# EAGLE design ledcontrol (EAGLE 7.2.0)
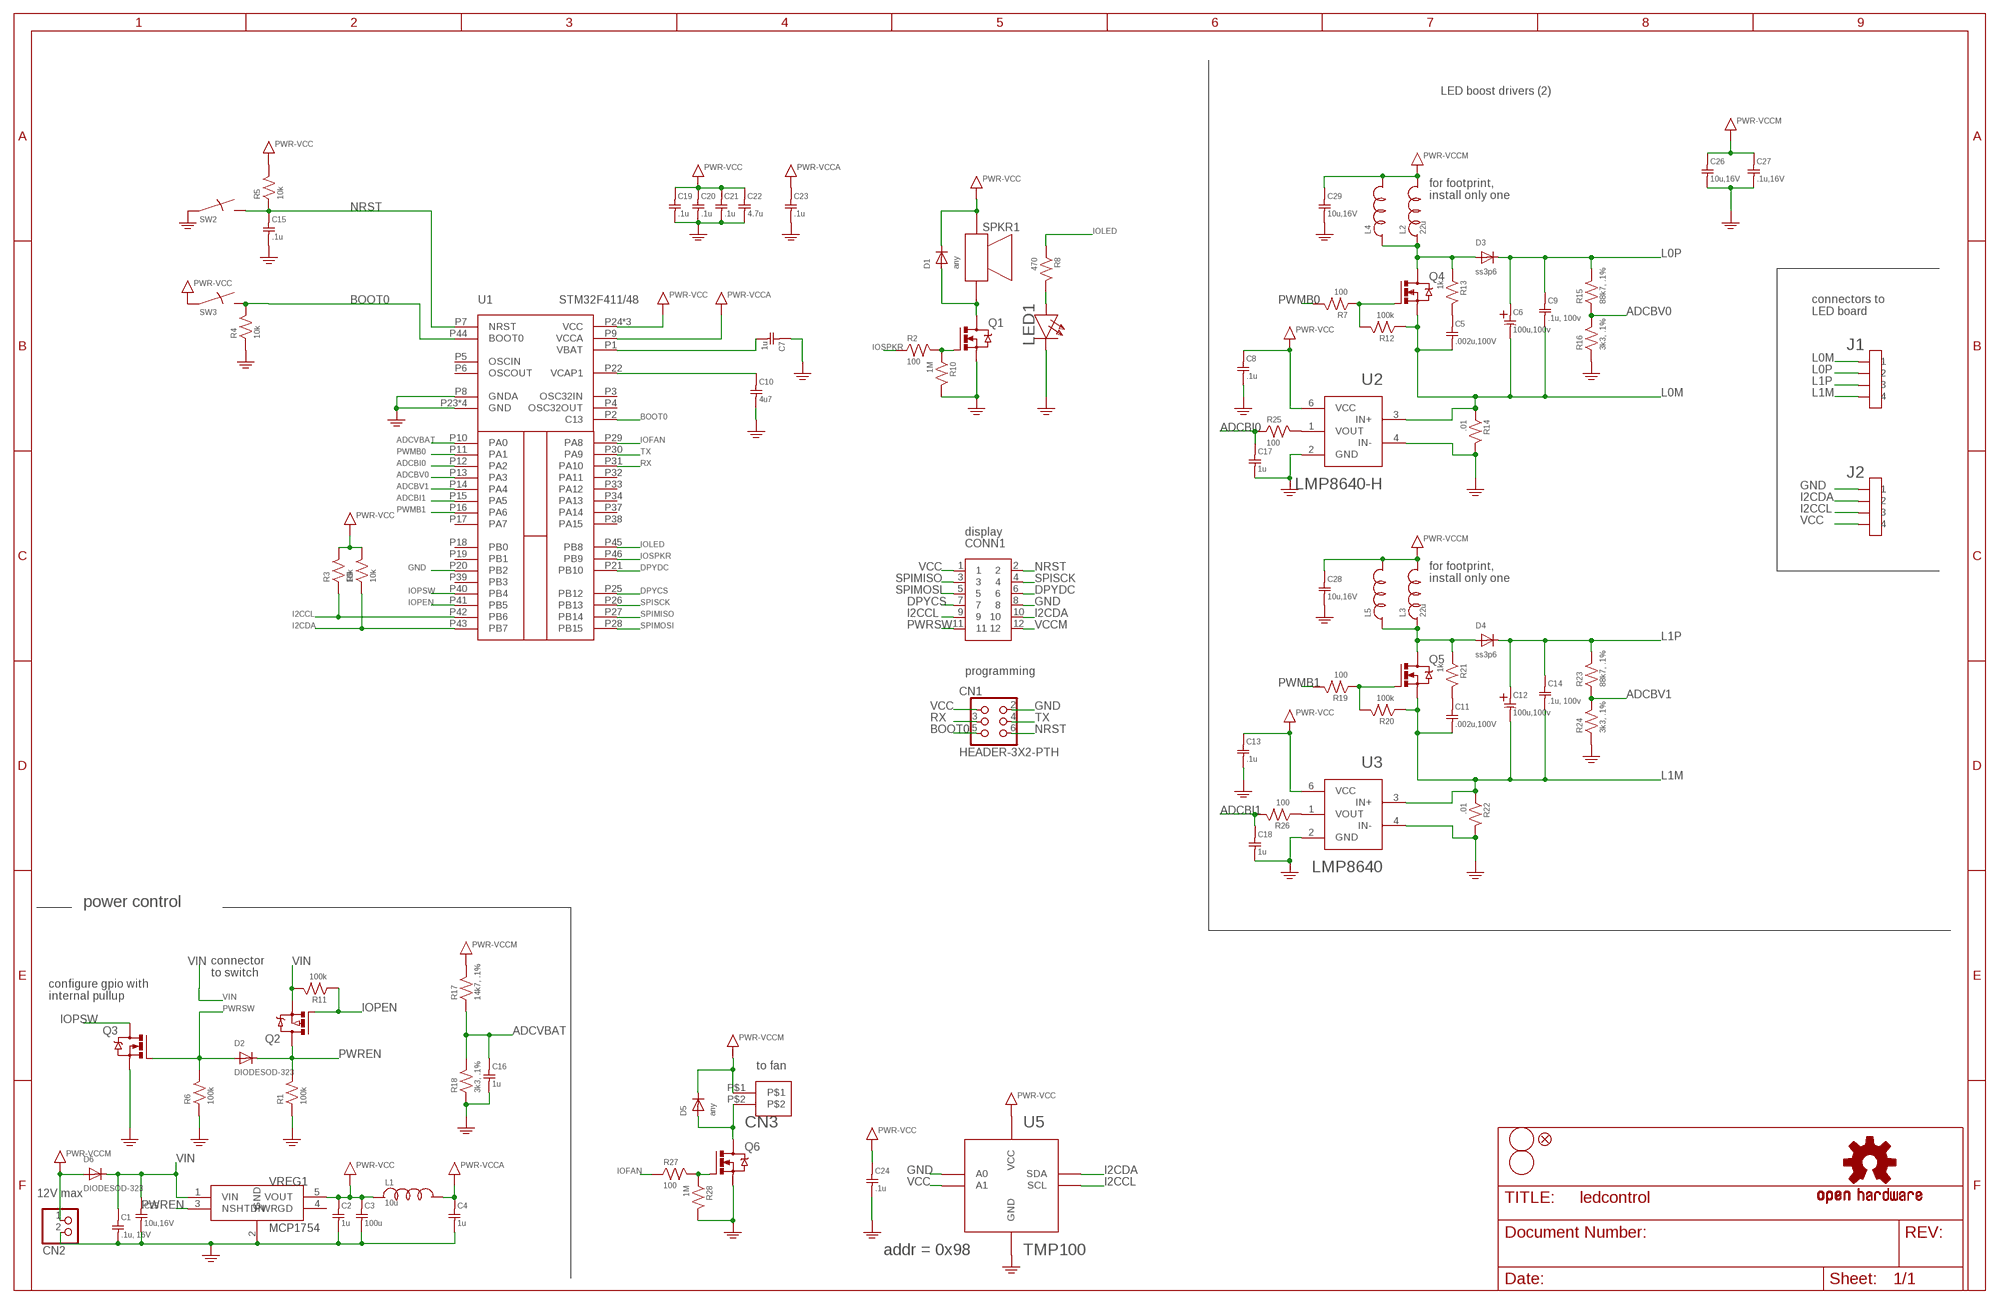
[diagram p0: schematic, sheet 1]

## Parts
C1  .1u, 16V  C0603  [SMD0603]
C2  1u  C0603  [SMD0603]
C3  100u  C1210  [SMD1210]
C4  1u  C0603  [SMD0603]
C5  .002u,100V  C0603  [SMD0603]
C6  100u,100v  C-POL-KE0  [CAPKE0]
C7  1u  C0603  [SMD0603]
C8  .1u  C0603  [SMD0603]
C9  .1u, 100v  C0805  [SMD0805]
C10  4u7  C0603  [SMD0603]
C11  .002u,100V  C0603  [SMD0603]
C12  100u,100v  C-POL-KE0  [CAPKE0]
C13  .1u  C0603  [SMD0603]
C14  .1u, 100v  C0805  [SMD0805]
C15  .1u  C0603  [SMD0603]
C16  1u  C0603  [SMD0603]
C17  1u  C0603  [SMD0603]
C18  1u  C0603  [SMD0603]
C19  .1u  C0603  [SMD0603]
C20  .1u  C0603  [SMD0603]
C21  .1u  C0603  [SMD0603]
C22  4.7u  C0603  [SMD0603]
C23  .1u  C0603  [SMD0603]
C24  .1u  C0603  [SMD0603]
C25  10u,16V  C0603  [SMD0603]
C26  10u,16V  C0603  [SMD0603]
C27  .1u,16V  C0603  [SMD0603]
C28  10u,16V  C0603  [SMD0603]
C29  10u,16V  C0603  [SMD0603]
CN1  HEADER-3X2-PTH  [HEADER-3X2-PTH]
CN2  JST_2PIN-THM-RA  [JST-PH-2-THM-RA]
CN3  HEADER-1X2-THM  [HEADER-1X2-THM]
CONN1  HEADER-6X2-PTH  [HEADER-6X2-PTH]
D1  any  DIODESOD-323  [SOD-323]
D2  DIODESOD-323  [SOD-323]
D3  ss3p6  DIODEDO-214AC  [DO-214AC]
D4  ss3p6  DIODEDO-214AC  [DO-214AC]
D5  any  DIODESOD-323  [SOD-323]
D6  DIODESOD-323  [SOD-323]
FID1  FIDUCIALUFIDUCIAL  [MICRO-FIDUCIAL]
J1  HEADER-4X1-PTH  [HEADER-4X1-PTH]
J2  HEADER-4X1-PTH  [HEADER-4X1-PTH]
L1  10u  LSMD0603  [SMD0603]
L2  22u  L2303  [BOURNS2303]
L3  22u  L2303  [BOURNS2303]
L4  L-SRR1260  [SRR1260]
L5  L-SRR1260  [SRR1260]
LED1  white  LED  [SMD0603D]
LOGO1  OSHW-LOGOS  [OSHW-LOGO-S]
Q1  IRLML6344TRPBF  MOSFETSOT-23  [SOT-23-3]
Q2  MOSFET-P  [SOT-23-3@1]
Q3  MOSFETSOT-23  [SOT-23-3]
Q4  AON6246  MOSFET-DFN5X6  [DFN5X6-8LEP1]
Q5  AON6246  MOSFET-DFN5X6  [DFN5X6-8LEP1]
Q6  IRLML6344TRPBF  MOSFETSOT-23  [SOT-23-3]
R1  100k  R0603  [SMD0603]
R2  100  R0603  [SMD0603]
R3  10k  R0603  [SMD0603]
R4  10k  R0603  [SMD0603]
R5  10k  R0603  [SMD0603]
R6  100k  R0603  [SMD0603]
R7  100  R0603  [SMD0603]
R8  470  R0603  [SMD0603]
R9  10k  R0603  [SMD0603]
R10  1M  R0603  [SMD0603]
R11  100k  R0603  [SMD0603]
R12  100k  R0603  [SMD0603]
R13  1k  R0603  [SMD0603]
R14  .01  R1206  [SMD1206]
R15  88k7, .1%  R0603  [SMD0603]
R16  3k3, .1%  R0603  [SMD0603]
R17  14k7, .1%  R0603  [SMD0603]
R18  3k3, .1%  R0603  [SMD0603]
R19  100  R0603  [SMD0603]
R20  100k  R0603  [SMD0603]
R21  1k  R0603  [SMD0603]
R22  .01  R1206  [SMD1206]
R23  88k7, .1%  R0603  [SMD0603]
R24  3k3, .1%  R0603  [SMD0603]
R25  100  R0603  [SMD0603]
R26  100  R0603  [SMD0603]
R27  100  R0603  [SMD0603]
R28  1M  R0603  [SMD0603]
SPKR1  PUI-5040  [PUI-0540]
SW2  SWITCHKMR211  [KMR211]
SW3  SWITCHKMR211  [KMR211]
U1  STM32F411/48  [UQPFN48]
U2  LMP8640-H  LMP8640  [SOT-23-6]
U3  LMP8640  [SOT-23-6]
U5  TMP100  [SOT-23-6]
U$1  FIDUCIAL  [FIDUCIAL_1MM]
U$2  FIDUCIAL  [FIDUCIAL_1MM]
VREG1  MCP1754  MCP1824  [SOT-23-5]

## Nets
ADCBI0: C17.1 R25.1 U1.P12(PA2)
ADCBI1: C18.1 R26.2 U1.P15(PA5)
ADCBV0: R15.1 R16.2 U1.P13(PA3)
ADCBV1: R23.1 R24.2 U1.P14(PA4)
ADCVBAT: C16.1 R17.1 R18.2 U1.P10(PA0)
BOOT0: CN1.5 R4.2 SW3.2 SW3.4 U1.P2(C13) U1.P44(BOOT0)
DPYCS: CONN1.7 U1.P25(PB12)
DPYDC: CONN1.6 U1.P21(PB10)
GND: C1.2 C2.2 C3.2 C4.2 C7.1 C8.2 C10.2 C13.2 C15.2 C16.2 C17.2 C18.2 C19.2 C20.2 C21.2 C22.2 C23.2 C24.2 C25.2 C26.2 C27.2 C28.2 C29.2 CN1.2 CN2.2 CONN1.8 J2.P$1 LED1.C Q1.2(S) Q3.2(S) Q6.2(S) R1.1 R4.1 R6.1 R10.2 R14.2 R16.1 R18.1 R22.2 R24.1 R28.2 SW2.1 SW2.3 U1.P8(GNDA) U1.P20(PB2) U1.P23(GND) U1.P35(GND) U1.P47(GND) U1.PAD(GND) U2.2(GND) U2.4(IN-) U3.2(GND) U3.4(IN-) U5.2(GND) U5.5(A0) VREG1.2(GND) ; supply symbol labelled PWR-GND
I2CCL: CONN1.9 J2.P$3 R3.1 U1.P42(PB6) U5.1(SCL)
I2CDA: CONN1.10 J2.P$2 R9.1 U1.P43(PB7) U5.6(SDA)
IOFAN: R27.1 U1.P29(PA8)
IOLED: R8.1 U1.P45(PB8)
IOPEN: Q2.1(G) R11.1 U1.P41(PB5)
IOPSW: Q3.3(D) U1.P40(PB4)
IOSPKR: R2.1 U1.P46(PB9)
L0M: C5.2 C6.N C9.2 J1.P$1 Q4.P$1(S) Q4.P$2(S) Q4.P$3(S) R12.1 R14.1 U2.3(IN+)
L0P: C6.P C9.1 D3.C J1.P$2 R15.2
L1M: C11.2 C12.N C14.2 J1.P$4 Q5.P$1(S) Q5.P$2(S) Q5.P$3(S) R20.1 R22.1 U3.3(IN+)
L1P: C12.P C14.1 D4.C J1.P$3 R23.2
N$2: D3.A L2.P$1 L4.P$1 Q4.P$5(D) Q4.P$6(D) Q4.P$7(D) Q4.P$8(D) Q4.P$9(D) R13.1
N$4: C5.1 R13.2
N$6: Q4.P$4(G) R7.1 R12.2
N$9: Q1.1(G) R2.2 R10.1
N$11: LED1.A R8.2
N$12: D4.A L3.P$1 L5.P$1 Q5.P$5(D) Q5.P$6(D) Q5.P$7(D) Q5.P$8(D) Q5.P$9(D) R21.1
N$13: C11.1 R21.2
N$14: D1.A Q1.3(D) SPKR1.P2
N$15: Q5.P$4(G) R19.1 R20.2
N$16: R25.2 U2.1(VOUT)
N$17: R26.1 U3.1(VOUT)
N$18: C10.1 U1.P22(VCAP1)
N$19: CN3.P$2 D5.A Q6.3(D)
N$20: Q6.1(G) R27.2 R28.1
N$21: C7.2 U1.P1(VBAT)
NRST: C15.1 CN1.6 CONN1.2 R5.1 SW2.2 SW2.4 U1.P7(NRST)
PWMB0: R7.2 U1.P11(PA1)
PWMB1: R19.2 U1.P16(PA6)
PWREN: D2.C Q2.3(D) R1.2 VREG1.3(NSHTDN)
PWRSW: CONN1.11 D2.A Q3.1(G) R6.2
RX: CN1.3 U1.P31(PA10)
SPIMISO: CONN1.3 U1.P27(PB14)
SPIMOSI: CONN1.5 U1.P28(PB15)
SPISCK: CONN1.4 U1.P26(PB13)
TX: CN1.4 U1.P30(PA9)
VCC: C2.1 C3.1 C8.1 C13.1 C19.1 C20.1 C21.1 C22.1 C24.1 CN1.1 CONN1.1 D1.C J2.P$4 L1.1 R3.2 R5.2 R9.2 SPKR1.P1 SW3.1 SW3.3 U1.P24(VCC) U1.P36(VCC) U1.P48(VCC) U2.6(VCC) U3.6(VCC) U5.3(A1) U5.4(VCC) VREG1.5(VOUT) ; supply symbol labelled PWR-VCC
VCCA: C4.1 C23.1 L1.2 U1.P9(VCCA) ; supply symbol labelled PWR-VCCA
VCCM: C26.1 C27.1 C28.1 C29.1 CN2.1 CN3.P$1 CONN1.12 D5.C D6.A L2.P$2 L3.P$2 L4.P$2 L5.P$2 R17.2 ; supply symbol labelled PWR-VCCM
VIN: C1.1 C25.1 D6.C Q2.2(S) R11.2 VREG1.1(VIN)
Unconnected: U1.P3(OSC32IN) U1.P4(OSC32OUT) U1.P5(OSCIN) U1.P6(OSCOUT) U1.P17(PA7) U1.P18(PB0) U1.P19(PB1) U1.P32(PA11) U1.P33(PA12) U1.P34(PA13) U1.P37(PA14) U1.P38(PA15) U1.P39(PB3) VREG1.4(PWRGD)

## Notes on the sheet
- LED boost drivers (2)
- for footprint, 
  install only one
- connectors to
  LED board
- display
- for footprint, 
  install only one
- programming
- power control
- connector
  to switch
- configure gpio with 
  internal pullup
- to fan
- 12V max
- addr = 0x98

## Library data of the parts
C1-C5 C7-C11 C13-C29 = jaw:C
C6 C12 = jaw:C-POL
CN1 = jaw:HEADER-3X2
CN2 = adafruit:JST_2PIN: JST 2-Pin Connectors of various flavors SMT-RA (S2B-PH-SM4) 4UConnector #17311 SMT (B2B-PH-SM4) THM-RA (S2B-PH) THM (B2B-PH)
CN3 = jaw:HEADER-1X2
CONN1 = jaw:HEADER-6X2
D1-D6 = jaw:DIODE
FID1 = SparkFun-Aesthetics:FIDUCIAL: Fiducial Alignment Points Various fiducial points for machine vision alignment.
J1 J2 = jaw:HEADER-4X1
L1-L5 = jaw:L
LED1 = jaw:LED
LOGO1 = SparkFun-Aesthetics:OSHW-LOGO: Open Source Hardware Logo This logo indicates the piece of hardware it is found on incorporates a OSHW license and/or adheres to the definition of open source hardware found here: http://freedomdefined.org/OSHW
Q1 Q3-Q6 = jaw:MOSFET
Q2 = jaw:MOSFET-P
R1-R28 = jaw:R
SPKR1 = jaw:PUI-5040
SW2 SW3 = jaw:SWITCH
U1 = jaw:STM32F411/48
U2 U3 = jaw:LMP8640
U5 = jaw:TMP100
U$1 U$2 = adafruit:FIDUCIAL: For use by pick and place machines to calibrate the vision/machine, 1mm By microbuilder.eu
VREG1 = jaw:MCP1824

## Board
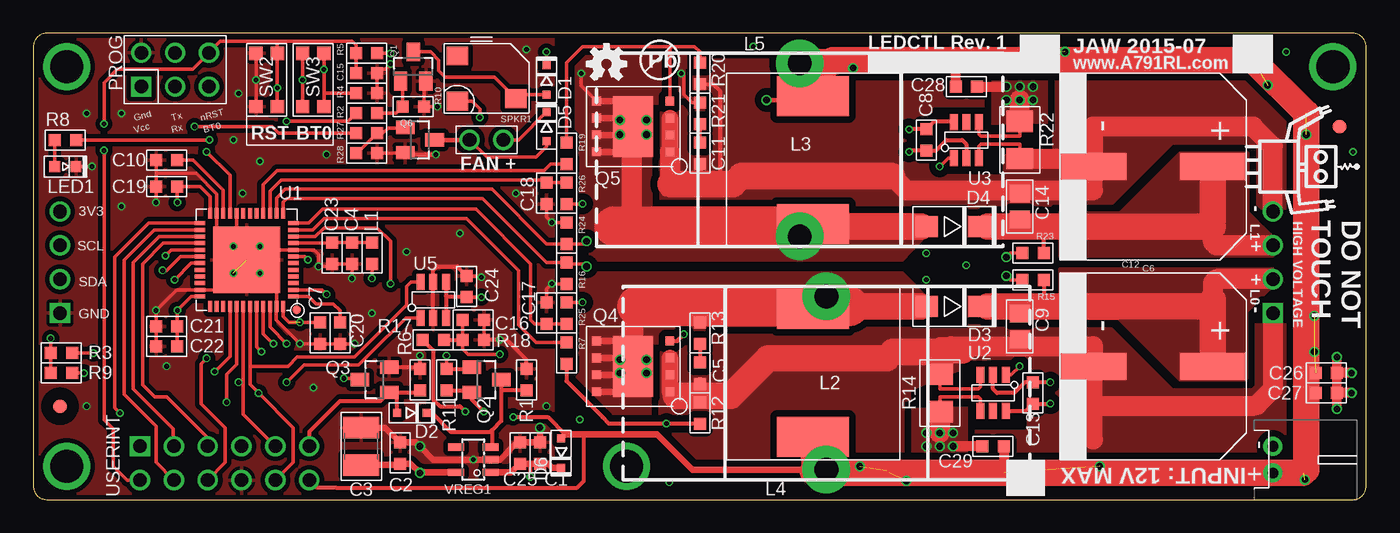
[diagram p1: board, top side]
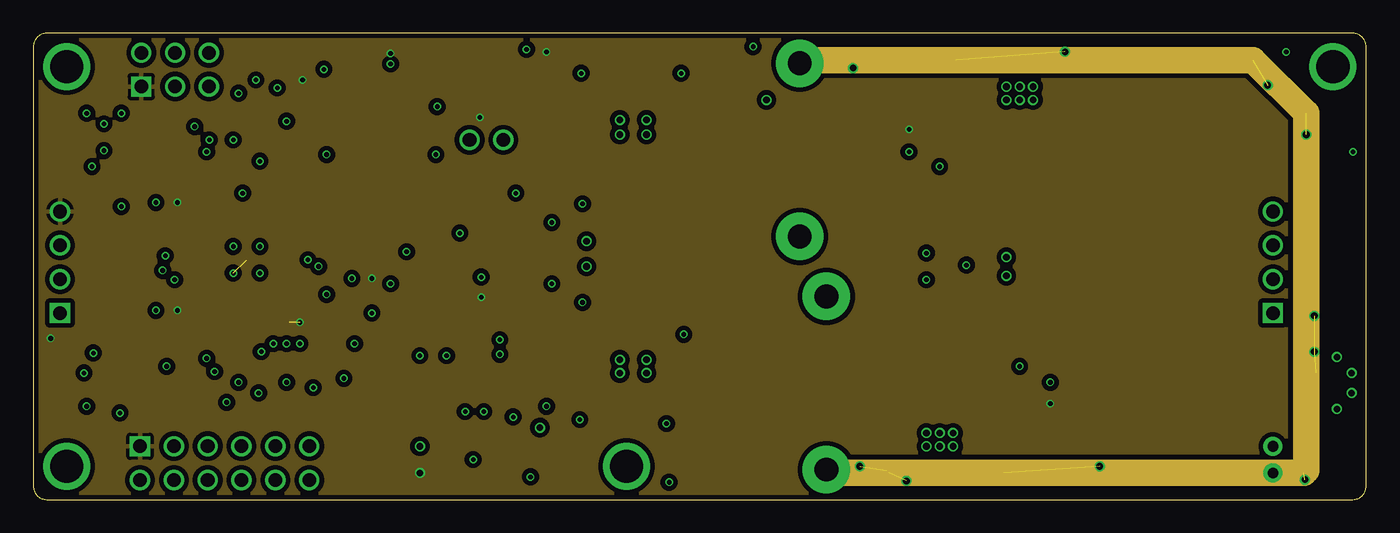
[diagram p2: board, inner layer Route2]
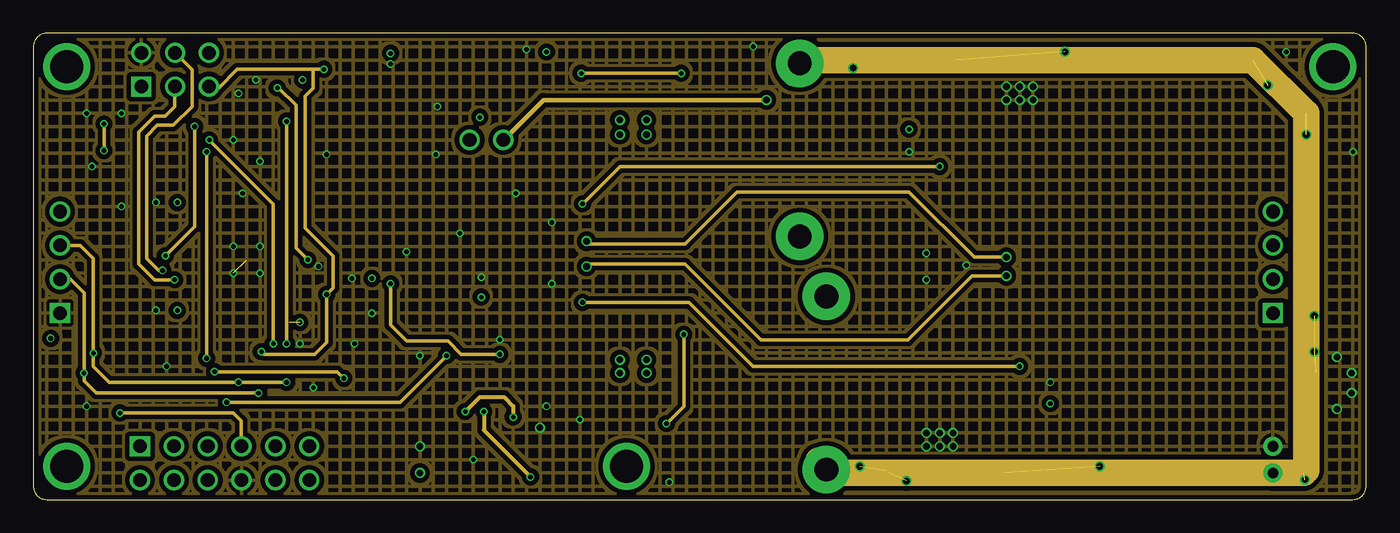
[diagram p3: board, inner layer Route15]
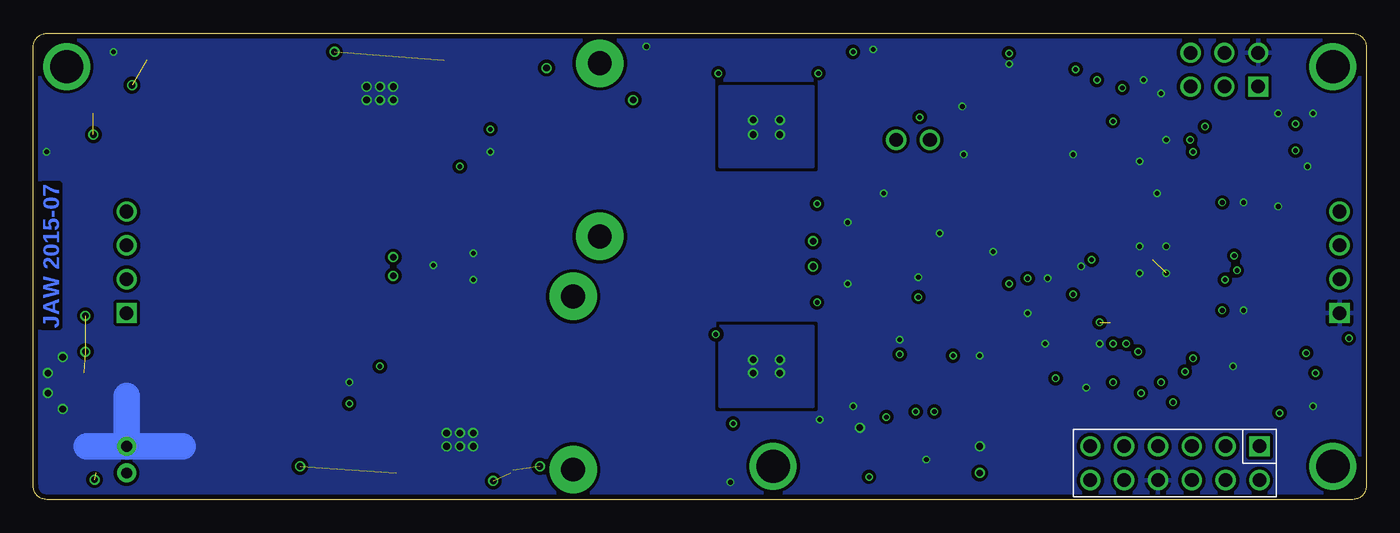
[diagram p4: board, bottom side, seen from below]

Size 100 x 35 mm. Coordinates in mm from the lower left corner, seen from the top.
Outline: 99,35 1,35 arc90 0,34 0,1 arc90 1,0 99,0 arc90 100,1 100,34 arc90 99,35
Copper layers (1*2*15*16): Top 0.035559375mm / dielectric 0.17018125mm / Route2 0.01778125mm / dielectric 47mil / Route15 0.01778125mm / dielectric 0.17018125mm / Bottom 0.035559375mm
Design rules "dirt_cheap_dirty_boards.v1 *": minimum track width 5mil, minimum drill 10mil, track to track 5mil, track to pad 5mil, pad to pad 5mil, via to via 5mil, smd to smd 5mil, copper to edge 15mil, drill to drill 6mil, minimum pad ring 4mil, minimum via ring 4mil, stop-mask expansion 4mil, vias tented up to drill 0.5mm, thermal gap 10mil
tKeepout: area -0.4,29.6 to 5.4,35.4; area -0.4,-0.4 to 5.4,5.4; area 41.6,-0.4 to 47.4,5.4; area 94.6,29.6 to 100.4,35.4

### Footprints (pad centres in the part's own frame; a part is rotated, then mirrored left to right if it is on the bottom)
SMD0603 = smd 0.9 x 0.9: 1 -0.8,0; 2 0.8,0
SMD1210 = smd 1.6 x 2.7: 1 -1.4,0; 2 1.4,0
CAPKE0 = smd 2 x 5: N 0,-4.5; P 0,4.5
SMD0805 = smd 1.3 x 1.5: 1 -0.95,0; 2 0.95,0
HEADER-3X2-PTH = drill 1.016 square: 1 0,0 | drill 1.016: 2 0,2.54; 3 2.54,0; 4 2.54,2.54; 5 5.08,0; 6 5.08,2.54
JST-PH-2-THM-RA = drill 0.8 pad 1.422: 1 1,0; 2 -1,0
HEADER-1X2-THM = drill 1.016 pad 1.524: P$1 -1.27,0; P$2 1.27,0
HEADER-6X2-PTH = drill 1.016 square: 1 0,0 | drill 1.016: 2 0,2.54; 3 2.54,0; 4 2.54,2.54; 5 5.08,0; 6 5.08,2.54; 7 7.62,0; 8 7.62,2.54; 9 10.16,0; 10 10.16,2.54; 11 12.7,0; 12 12.7,2.54
SOD-323 = smd 0.6 x 0.6: A 1.1,0; C -1.1,0
DO-214AC = smd 1.75 x 1.6: A 2,0; C -2,0
MICRO-FIDUCIAL = smd 0.635 x 0.635: 1 0,0
HEADER-4X1-PTH = drill 1.016 square: P$1 0,0 | drill 1.016: P$2 2.54,0; P$3 5.08,0; P$4 7.62,0
BOURNS2303 = drill 1.778 pad 3.556: P$1 -6.5,0; P$2 6.5,0
SRR1260 = smd 3 x 5.4: P$1 -4.8,0; P$2 4.8,0
SMD0603D = smd 0.8 x 0.8: A -0.8,0; C 0.8,0
SOT-23-3 = smd 1.4 x 1: 1 -1.1,0.95; 2 -1.1,-0.95; 3 1.1,0
SOT-23-3@1 = smd 1 x 1.4: 1 -0.95,-1.1; 2 0.95,-1.1; 3 0,1.1
DFN5X6-8LEP1 = smd 0.65 x 0.65: P$1 -1.905,-2.75; P$2 -0.635,-2.75; P$3 0.635,-2.75; P$4 1.905,-2.75; P$5 1.905,2.75; P$6 0.635,2.75; P$7 -0.635,2.75; P$8 -1.905,2.75 | smd 4.6 x 3: P$9 0,0
SMD1206 = smd 1.6 x 2: 1 -1.4,0; 2 1.4,0
PUI-0540 = smd 1.4 x 1.6: NC 1.8,2.2; P1 -1.6,2.2; P2 -1.4,-2.2
KMR211 = smd 1 x 1: 1 -2,0.8; 2 -2,-0.8; 3 2,0.8; 4 2,-0.8
UQPFN48 = smd 0.3 x 0.8: P1 -2.75,-3.5; P2 -2.25,-3.5; P3 -1.75,-3.5; P4 -1.25,-3.5; P5 -0.75,-3.5; P6 -0.25,-3.5; P7 0.25,-3.5; P8 0.75,-3.5; P9 1.25,-3.5; P10 1.75,-3.5; P11 2.25,-3.5; P12 2.75,-3.5; P25 2.75,3.5; P26 2.25,3.5; P27 1.75,3.5; P28 1.25,3.5; P29 0.75,3.5; P30 0.25,3.5; P31 -0.25,3.5; P32 -0.75,3.5; P33 -1.25,3.5; P34 -1.75,3.5; P35 -2.25,3.5; P36 -2.75,3.5 | smd 0.8 x 0.3: P13 3.5,-2.75; P14 3.5,-2.25; P15 3.5,-1.75; P16 3.5,-1.25; P17 3.5,-0.75; P18 3.5,-0.25; P19 3.5,0.25; P20 3.5,0.75; P21 3.5,1.25; P22 3.5,1.75; P23 3.5,2.25; P24 3.5,2.75; P37 -3.5,2.75; P38 -3.5,2.25; P39 -3.5,1.75; P40 -3.5,1.25; P41 -3.5,0.75; P42 -3.5,0.25; P43 -3.5,-0.25; P44 -3.5,-0.75; P45 -3.5,-1.25; P46 -3.5,-1.75; P47 -3.5,-2.25; P48 -3.5,-2.75 | smd 5 x 5: PAD 0,0
SOT-23-6 = smd 1.2 x 0.6: 1 -1.35,0.95; 2 -1.35,0; 3 -1.35,-0.95; 4 1.35,-0.95; 5 1.35,0; 6 1.35,0.95
FIDUCIAL_1MM = smd 1 x 1: 1 0,0
SOT-23-5 = smd 0.55 x 1.2: 1 -0.95,-1.3; 2 0,-1.3; 3 0.95,-1.3; 4 0.95,1.3; 5 -0.95,1.3

### Placement (x,y rotation side)
C1  38,3.5 90 top
C2  27.5,3.5 90 top
C3  24.6,4 90 top
C4  23.9,18.5 270 top
C5  50,9.5 270 top
C6  84,10 270 top
C7  23,12.5 90 top
C8  67,27 270 top
C9  74,13 270 top
C10  10,25.5 180 top
C11  50,26 270 top
C12  84,25 270 top
C13  75,8 90 top
C14  74,22 90 top
C15  25,32 0 top
C16  33,13.5 0 top
C17  38.5,14 90 top
C18  38.5,23 270 top
C19  10,23.5 180 top
C20  21.5,12.5 270 top
C21  10,13 180 top
C22  10,11.5 180 top
C23  22.4,18.5 270 top
C24  32.5,16 90 top
C25  36.5,3.5 90 top
C26  97,9.5 0 top
C27  97,8 0 top
C28  70,31 0 top
C29  72,4 180 top
CN1  8.1,31 0 top
CN2  93,3 270 top
CN3  34,27 180 top
CONN1  8,4 180 bottom
D1  38.5,31.5 270 top
D2  28.4,6.5 180 top
D3  69,14.5 180 top
D4  69,20.5 180 top
D5  38.5,28 270 top
D6  39.6,3.5 90 top
FID1  19.75,14.25 0 top
J1  93,14 90 top
J2  2,14 90 top
L1  25.4,18.5 90 top
L2  59.5,8.75 270 top
L3  57.5,26.25 90 top
L4  58.5,9.5 270 top
L5  58.5,25.5 90 top
LED1  2.4,25 0 top
LOGO1  43,32.7 0 top
Q1  28.5,32.5 90 top
Q2  34,9 270 top
Q3  25.6,9 180 top
Q4  45,10 90 top
Q5  45,28 90 top
Q6  29,27 0 top
R1  37,9 270 top
R2  25,29 0 top
R3  2.1,11 180 top
R4  25,30.5 180 top
R5  25,33.5 0 top
R6  29,9 270 top
R7  40,11 90 top
R8  2.4,27 180 top
R9  2.1,9.5 180 top
R10  28.5,29.5 0 top
R11  31,9 270 top
R12  50,6.5 270 top
R13  50,12.5 270 top
R14  68,8 270 top
R15  75,16.5 0 top
R16  40,17 90 top
R17  30,12 180 top
R18  33,12 180 top
R19  40,26 270 top
R20  50,32 90 top
R21  50,29 270 top
R22  74,27 90 top
R23  75,18.5 0 top
R24  40,20 270 top
R25  40,14 90 top
R26  40,23 90 top
R27  25,27.5 0 top
R28  25,26 0 top
SPKR1  34,31.5 90 top
SW2  17.5,31.5 90 top
SW3  21,31.5 90 top
U1  16,18 90 top
U2  72,8 270 top
U3  70,27 90 top
U5  30,15 90 top
U$1  98,28 0 top
U$2  2,7 0 top
VREG1  33,3 90 top

### Tracks (layer width: path | path; a pad name or v marks a point on that pad's centre or on a via)
ADCBI0
  Top 0.25: U1.P12 20.65,20.75 21.7,21.8 33.2,21.8 37.3,17.7 37.3,13.5 37.6,13.2 C17.1 R25.1
ADCBI1
  Top 0.25: U1.P15 17.75,23.15 18.6,24 36.1,24 38.3,24 C18.1 R26.2
ADCBV0  (via drill 0.5)
  Top 0.25: U1.P13 18.75,22.35 19,22.6 33.7,22.6 38.5,17.8 R16.2 40.1,17.7 41.3,17.7 v41.5,17.5 | R15.1 73.3,16.5 v73,16.8
  Route15 0.25: v73,16.8 70.4,16.8 65.6,12 54.6,12 48.9,17.7 41.7,17.7 v41.5,17.5
ADCBV1  (via drill 0.5)
  Top 0.25: U1.P14 18.25,22.65 18.9,23.3 34.4,23.3 38.5,19.2 R24.2 41.3,19.2 v41.5,19.4 | R23.1 73.3,18.5 v73,18.2
  Route15 0.25: v73,18.2 70.6,18.2 65.7,23.1 52.8,23.1 48.9,19.2 41.7,19.2 v41.5,19.4
ADCVBAT  (via drill 0.35)
  Top 0.25: U1.P10 21.15,19.75 21.8,20.4 25.5,20.4 25.8,20.4 26.8,19.4 26.8,16.4 v26.8,16.2 | 32.3,13.6 C16.1 R18.2 32.2,11.3 32.6,10.9 v35,10.9
  Top 0.3: R17.1 R18.2
  Route15 0.25: v35,10.9 32.1,10.9 31.1,11.9 28,11.9 26.8,13.1 v26.8,16.2
BOOT0  (via drill 0.35)
  Top 0.25: SW3.4 v21.8,32.3 21.8,30.5 | 21.8,30.5 SW3.2 | R4.2 21.8,30.5 | U1.P44 16.75,11.45 v17.1,11.1 | v22,15.4 21.65,15.75 U1.P2
  Route15 0.25: 21,32.3 15.4,32.3 15.3,32.3 13.9,30.9 13.28,30.9 CN1.5 | 21,32.3 v21.8,32.3 | v17.1,11.1 17.3,10.9 21.1,10.9 22,11.8 v22,15.4 22.5,15.9 22.5,18.3 20.4,20.4 20.4,30 20.4,30.3 21,30.9 21,32.3
DPYCS  (via drill 0.35)
  Top 0.25: U1.P25 8.65,20.75 6.1,18.2 6.1,6.9 v6.5,6.5
  Route15 0.25: v6.5,6.5 15,6.5 15.6,5.9 15.6,4.02 CONN1.7
DPYDC  (via drill 0.35)
  Top 0.25: U1.P21 14.75,24.35 v13,26.1 | CONN1.6 14.4,2.78 14.4,5.4 12.6,7.2 12.6,10.2 v13,10.6
  Route15 0.25: v13,26.1 v13,10.6
GND  (via drill 0.35, 0.5)  (1 unrouted)
  Top 0.25: U2.4 71.05,7.55 70.9,7.7 68,7.7 R14.2 | U3.4 70.95,27.45 71.1,27.3 74,27.3 R22.2 | U1.P20 15.25,19.25 v15,19 13.75,20.25 U1.P23 13.75,22.95 12.2,24.5 9.3,24.5 9.2,24.6 | v17,19 17.25,18.75 U1.P8 21.05,18.75 21.4,18.4 v21.4,17.5 22.2,17.5 C23.2 C4.2 v23.9,16.6 | U1.P47 18.25,15.75 v17,17 | v15,17 13.75,15.75 U1.P35 10.75,15.75 v9.2,14.2 C21.2 C22.2 | C10.2 9.2,24.6 | 9.2,24.6 C19.2 v9.2,22.3 | SW2.3 v16.7,31.5 SW2.1 | R4.1 C15.2 25.8,32.3 26.4,32.3 v26.8,32.7 | Q1.2 29.3,30.9 R10.2 30.1,29.5 v30.3,29.5 | C16.2 R18.1 | R16.1 39.5,16.2 v38.9,16.2 38.5,15.8 C17.2 | R24.1 v38.9,20.8 38.5,21.2 C18.2 | LED1.C v4.4,25 | R28.2 27.35,26 Q6.2 | 18.2,14.6 18.2,13.5 v20,11.7 C20.2 C7.1 v24.1,11.7
  Top 0.3: v76.3,8.8 C13.2 74.4,8.8 73.6,8 72.3,8 72,8.3 U2.2 | v65.7,26.1 65.8,26.2 C8.2 67.7,26.2 68.5,27 69.7,27 70,26.7 U3.2 | Q3.2 29.05,9.95 | R6.1 v29,10.8 | 33.9,12.1 R18.1 35.5,12 35.75,11.75 37,10.5 R1.1 | v33.6,16.7 33.5,16.8 C24.2 31.8,17.5 30.3,17.5 30,17.2 U5.5 U5.2
  Top 0.35: v30.2,25.9 28.05,25.9 Q6.2
  Top 0.5: 36.15,4.15 35,3 VREG1.2 30,3 v29,4 28.7,4.3 C2.2 26.4,5.4 C3.2 | 36.15,4.15 36.3,4.3 C1.2 v38,5.4 | 29.05,9.95 R6.1 | C25.2 36.55,4.15 36.15,4.15
  Top 0.7: v97.8,10.7 C26.2 C27.2 v97.8,6.8
  Top 0.75: v98.9,8 C27.2 | v98.9,9.5 97.9,9.5 | C28.2 v73,31 | C29.2 v69,4
  Top 1.5: R22.2 v74,30 | R14.2 v68,5
  Bottom 2: CN2.2 93,7.8 | 88.8,4 92.9,4 | 92.9,4 CN2.2 | CN2.2 92.9,4 | 92.9,4 96,4
  other vias: 69,5 68,4 67,4 67,5 75,31 75,30 74,31 73,30 35,12 15,27 15.7,23 22,25.9 37,33.8 21,8.4 4,7 15.4,30.5 17,25.4 6.6,22 4,29 32,20 28,18.6 38.5,7 25.4,14 10,10 41,6 99,26.1 54,34 47.7,1.3 33,3 36.2,23 6.6,29 94,33.6 70,17.6 67,18.5 67,16.5
  pour Top (isolate 0.5, no thermals): 72,28 72,31.6 76,31.6 76,28
  pour Top (isolate 0.5, no thermals): 70,7 70,3.5 66,3.5 66,7
  pour Route15 (isolate 0.35, hatched): 0,36 101,36 101,0 0,0
  pour Top (isolate 0.35): 0,0 39,0 39,35 0,35
  pour Bottom (isolate 0.25, rank 5): -0.1,35.9 100.9,35.9 100.9,-0.1 -0.1,-0.1
I2CCL  (via drill 0.35)
  Top 0.25: U1.P42 15.75,8.8 | 15.75,8.8 15.75,8.5 | 15.75,8.5 15.75,6.41 CONN1.9 | v15.4,8.8 15.75,8.8 | 15.75,8.8 15.75,8.5 | R3.1 v4.5,11 | v19,8.8 20.3,10.1 23.1,10.1 24.4,10.1 25.3,11 27.95,13.65 U5.1
  Route15 0.25: J2.P$3 3.52,19.08 4.5,18.1 v4.5,11 4.5,10 5.7,8.8 v15.4,8.8 17.4,8.8 18.1,8.8 v19,8.8
I2CDA  (via drill 0.35)
  Top 0.25: U1.P43 16.25,10.1 | 16.25,10.1 16.25,8.65 v16.9,8 19.5,5.4 19.5,2.8 CONN1.10 | R9.1 v3.8,9.5 | U5.6 28.35,16.35 28,16 28,14.6 26.5,13.1 24.1,10.7 22.1,10.7 19.8,10.7 19.1,10 16.35,10 16.25,10.1
  Route15 0.25: J2.P$2 2.76,16.54 3.8,15.5 v3.8,9.5 3.8,8.9 4.7,8 v16.9,8
IOFAN  (via drill 0.35)
  Top 0.25: U1.P29 10.35,18.75 v9.9,18.3 | R27.1 18.4,27.5 17.9,28 v12.1,28
  Route15 0.25: v9.9,18.3 12.1,20.5 v12.1,28
IOLED  (via drill 0.35)
  Top 0.25: U1.P45 17.25,12.45 v18,11.7 | v13.2,27 R8.1
  Route15 0.25: v18,11.7 18,22.2 v13.2,27
IOPEN  (via drill 0.35)
  Top 0.25: U1.P41 15.25,10.15 14.5,9.4 v14.5,7.3 | v31,10.8 R11.1
  Top 0.3: R11.1 32.75,9.8 Q2.1
  Route15 0.25: v14.5,7.3 27.5,7.3 v31,10.8
IOPSW  (via drill 0.35)
  Top 0.25: U1.P40 14.75,10.75 v13.6,9.6 | v23.3,9.1 24.6,9.1 Q3.3
  Route15 0.25: v13.6,9.6 22.8,9.6 v23.3,9.1
IOSPKR  (via drill 0.35)
  Top 0.25: U1.P46 17.75,12.95 v19,11.7 | R2.1 24.1,28.9 23.6,28.4 v19,28.4
  Route15 0.25: v19,11.7 19,13.7 v19,28.4
L0M
  Top 0.25: U2.3 71.05,8.45 70.9,8.3 68,8.3 R14.1
  Top 0.3: 50,8 C5.2 R12.1
  Top 0.5: C9.2 68.85,11.5
  Top 1: C5.2 50,8 48,8 47.84,8 Q4.P$1
  Top 1.25: Q4.P$1 Q4.P$3
  Top 1.5: J1.P$1 93,8.5 | 91.5,7 79.5,7 | 79.5,7 C6.N 79.5,11.5 68.85,11.5 69.7,11.2 | 79.5,4.5 79.5,7 | 48.2,7.8 48,8 | 91.7,7.1 91.8,7.1 93,8.3 | R14.1 68,11.1 68.1,11.2
  Top 2: 48.2,7.8 52.3,7.8 55.1,10.6 58,10.6 59.2,10.6 64,10.6 64.5,11.1 68,11.1 | 68.1,11.2 69.7,11.2
  pour Top (isolate 0.5, rank 3, no thermals): 94,13.1 47,13.1 47,2 94,2
L0P
  Top 0.3: R15.2 75.8,14.5 | 75.8,14.5 76,14.5 | 71.6,14.5 D3.C | 75.8,14.5 74.55,14.5 C9.1
  Top 0.5: D3.C 71,14.7
  Top 1.5: J1.P$2 88.75,16.54 88.5,16.29 88.5,15 88.5,14.5
  Top 2: 88.5,15 C6.P | 76,14.5 88.5,14.5 | 75.8,14.5 71.6,14.5
  pour Top (isolate 0.5, rank 2, no thermals): 93,17.3 77,17.3 77,13.6 81.4,13.6 86,9 90.9,9 91,9.1 91,14.1 92.9,16 92.9,17.2
L1M
  Top 0.25: U3.3 70.95,26.55 71.1,26.7 74,26.7 R22.1
  Top 0.3: 47.31,22.95 50,22.95 | 50,22.95 51.5,22.95 51.5,30.7 51,31.2 R20.1 | C11.2 50,22.95
  Top 1: 47.8,23.7 47.6,23.9 47.75,24.05
  Top 1.25: Q5.P$1 Q5.P$3
  Top 1.5: J1.P$4 93,26.5 91.5,28 79.5,28 79.5,25.5 | 64.4,24.3 65.5,23.2 79.5,23.2 C12.N 79.5,25.6 R22.1 | Q5.P$1 47.75,24.05
  Top 2: 47.8,23.7 52.5,23.7 53.1,24.3 57.6,24.3 64.4,24.3
  pour Top (isolate 0.5, rank 3, no thermals): 94.1,21.9 47.1,21.9 47,33 94,33
L1P
  Top 0.3: R23.2 75.8,20.5 75.5,20.5 | 71.6,20.5 D4.C | 74.05,21 74.05,20.55 74.1,20.5
  Top 0.5: C14.1 74.05,21 | D4.C 71,20.8 71.25,21.05
  Top 1.5: J1.P$3 88.75,19.08 88.5,19.33 88.5,20.5 88.5,21
  Top 2: 88.5,21 C12.P | 88.5,20.5 75.5,20.5 74.1,20.5 71.6,20.5
  pour Top (isolate 0.5, rank 2, no thermals): 93,18.3 77,18.3 77,21.5 81.5,21.5 86,26 91.1,26 91.1,21.6 93,19.7
N$1
  cutout Top: 67.6,29.3 71,29.3 71,28 76.3,28.1 76.3,26.2 72.6,26 72.6,24.5 67.6,24.6
N$2  (via drill 0.5)
  Top 0.25: 45,14.3 49.7,14.3 50,14
  Top 0.3: R13.1 50,14 50,14.3
  Top 0.5: D3.A 66.6,14.5 | Q4.P$5 44.09,11.9 44.1,11.9 | Q4.P$6 44.03,10.63 44.1,10.7 | Q4.P$7 43.87,9.37 v44,9.5 | Q4.P$8 43.9,8.1
  Top 1.5: 45,14.3 45,14.2 45,10.2 Q4.P$9
  Top 2: 66.6,14.5 61.7,14.5 | 61.7,14.5 61.2,14.5 58.5,14.4 L4.P$1 | 45.3,14.5 45,14.2 | L2.P$1 61.75,14.45 61.7,14.5
  Top 3: 61.2,14.5 45.3,14.5
  other vias: 44,10.5 46,10.5 46,9.5
  pour Top (isolate 0.5, rank 4, no thermals): 40,17 65.2,17 67.2,15 56,14.9 55.9,2.9 40,2.9
  pour Bottom (isolate 0.3, rank 2): 41.5,13 48.5,13 48.5,7 41.5,7
N$3  (via drill 2.5)
  other vias: 2.5,2.5
N$4
  Top 0.3: R13.2 C5.1
N$5  (via drill 2.5)
  other vias: 2.5,32.5
N$6  (via drill 0.35)
  Top 0.25: 48.3,11.9 v48.8,12.4 | v47.5,5.7 47.4,5.7
  Top 0.3: R12.2 v47.5,5.7 47.4,5.7 43.19,5.7 42.69,6.2 42.69,6.21 41,7.9 40,8.9 R7.1 | Q4.P$4 48.3,11.9 v48.8,12.4
  Route15 0.25: v48.8,12.4 48.8,7 v47.5,5.7
N$7  (via drill 2.5)
  other vias: 97.5,32.5
N$8  (via drill 2.5)
  other vias: 44.5,2.5
N$9
  Top 0.25: Q1.1 27.7,30.9 R10.1 27.2,29 R2.2
N$10
  cutout Top: 66,7 70.3,7.1 70.6,7.1 70.6,5.4 74.4,5.4 74.4,10.3 69.6,10.3 69.7,9.6 66,8.1
N$11
  Top 0.25: R8.2 LED1.A
N$12  (via drill 0.35, 0.5)
  Top 0.25: R21.1 49.4,29.8 48.8,30.4 48.8,31.8 v48.6,32 | v41.1,32 41.1,31.05 Q5.P$5
  Top 0.3: R21.1 50,30.1
  Top 0.5: D4.A 66.6,20.5 | Q5.P$5 43.91,29.91 44,30 | Q5.P$6 43.97,28.64 44,28.6 | Q5.P$7 43.97,27.36 v44,27.4 | Q5.P$8 43.9,26.09 44,26.2
  Top 1.5: 44.9,20.7 44.9,27.9 Q5.P$9
  Top 2: 66.6,20.5 58.7,20.5 | 58.7,20.5 58.3,20.5 55.25,20.55 L3.P$1 | 43.6,20.5 44.9,20.7 | L5.P$1 58.7,20.5
  Top 3: 58.3,20.5 43.6,20.5
  Route15 0.25: v48.6,32 v41.1,32
  other vias: 44,28.5 46,28.5 46,27.4
  pour Top (isolate 0.5, rank 4, no thermals): 40,34 52,34 52,21.4 66.1,21.4 67,19.9 65.2,18 40,18
  pour Bottom (isolate 0.3, rank 2): 41.5,31 48.5,31 48.5,25 41.5,25
N$13
  Top 0.3: C11.1 R21.2
N$14
  Top 0.25: Q1.3 29.8,33.6 30.4,33 30.4,32.2 30.9,31.7 34.6,31.7 SPKR1.P2 36.5,30.4 D1.A
N$15
  Top 0.25: R20.2 50,33.6 49.6,34 47.7,34 | 47.7,34 41.2,34 40,32.8 R19.1 | Q5.P$4 47.75,33.95 47.7,34
N$16  (via drill 0.35)
  Top 0.25: U2.1 73.35,9.35 v74,10 | v41.2,14.8 R25.2
  Route15 0.25: v74,10 54,10 49.2,14.8 v41.2,14.8
N$17  (via drill 0.35)
  Top 0.25: U3.1 68.65,25.65 v68,25 | v41.2,22.2 R26.1
  Route15 0.25: v68,25 44,25 v41.2,22.2
N$18
  Top 0.25: U1.P22 14.25,23.25 12,25.5 C10.1
N$19
  Top 0.25: CN3.P$2 34.03,25.7 37.7,25.7 38.5,26.5 D5.A
  Top 0.35: CN3.P$2 Q6.3
N$20
  Top 0.25: R28.1 24.3,26 R27.2 26.2,27.5 26.6,27.9 27.35,27.9 Q6.1
N$21
  Top 0.25: U1.P1 20.65,15.25 21.2,14.7 22.5,14.7 23,14.2 C7.2
N$22
  cutout Top: 66,22 70,22 70,21 66,21
N$23
  cutout Top: 66,13 70,13 70,14 66,14
NRST  (via drill 0.35)
  Top 0.25: 18.3,31 SW2.4 18.3,34.4 | 18.3,31 v18.3,30.9 | v18.3,30.9 SW2.2 | C15.1 R5.1 24.2,34.1 23.9,34.4 18.5,34.4 18.3,34.4 | 18.3,34.4 14,34.4 13.14,33.54 CN1.6 11.94,32.3 6.3,32.3 5.3,31.3 v5.3,28.2 | U1.P7 20.35,18.25 v20.6,18 | v18.3,30.9 18.3,31 | CONN1.2 7.04,1.46 6,2.5 6,5.3 5.3,6 v5.3,26.2
  Route15 0.25: v5.3,26.2 v5.3,28.2 | v18.3,30.9 18.4,30.9 19.7,29.6 19.7,18.9 v20.6,18
PWMB0
  Top 0.25: U1.P11 20.95,20.25 21.8,21.1 32.5,21.1 36.4,17.2 36.4,13.1 37.7,11.8 R7.2
PWMB1
  Top 0.25: U1.P16 17.25,23.65 18.3,24.7 38.3,24.7 38.8,25.2 R19.2
PWREN
  Top 0.25: 35.2,8.2 35.1,8.3
  Top 0.3: R1.2 35.9,8.2 35.2,8.2 | 34.4,5 34.4,5.2 35.1,5.9 35.1,8.3 Q2.3 | 34.4,5 34.4,4.05 VREG1.3 | D2.C 29.9,6.5 31.3,5.1 34.3,5.1 34.4,5
PWRSW
  Top 0.3: 27.3,8.05 Q3.1 26.05,7.4 23,7.4 21,5.4 20.7,5.1 CONN1.11 | 27.3,8.05 28.95,8.05 | D2.A 27.3,8.05
  Top 0.5: 28.95,8.05 R6.2
RX  (via drill 0.35)
  Top 0.25: U1.P31 11.85,17.75 v10.6,16.5
  Route15 0.25: v10.6,16.5 9.1,16.5 7.9,17.7 7.9,27.6 9.1,28.8 9.9,28.8 10.6,29.5 10.6,30.96 CN1.3
SPIMISO
  Top 0.25: U1.P27 9.45,19.75 7.5,17.8 7.5,8.3 10.5,5.3 10.5,4.04 CONN1.3
SPIMOSI
  Top 0.25: U1.P28 9.75,19.25 8.2,17.7 8.2,8.6 9.1,7.7 10,7.7 13,4.7 13,4.08 CONN1.5
SPISCK
  Top 0.25: U1.P26 9.05,20.25 6.8,18 6.8,7.9 9.2,5.5 9.2,2.8 CONN1.4
TX  (via drill 0.35)
  Top 0.25: U1.P30 11.05,18.25 10,17.2 v9.7,17.2
  Route15 0.25: v9.7,17.2 9.4,17.2 8.5,18.1 8.5,27.3 9.3,28.1 10.5,28.1 11.9,29.5 11.9,32.28 CN1.4
VCC  (via drill 0.35, 0.5)  (1 unrouted)
  Top 0.25: C22.1 C21.1 v10.8,14.2 11.85,15.25 U1.P36 | U1.P48 18.75,13.75 19.2,13.3 C20.1 | v10.8,22.3 C19.1 12.5,23.5 13.25,22.75 U1.P24 | L1.1 v25.4,16.6 | SW3.3 v20.2,31.5 SW3.1 | R5.2 v26.8,33.5 | D1.C v38.5,33.6 | SPKR1.P1 32.9,29.9 33.5,29.3 v33.5,28.7 | R9.2 R3.2 v1.3,12.1
  Top 0.3: U2.6 74.45,6.65 C13.1 v76.3,7.2 | v65.7,27.8 C8.1 67.55,28.35 U3.6 | v33.6,15.2 C24.1 31.05,15.2 30.95,15.3 | U5.4 30.95,15.3 | 30.95,15.3 U5.3
  Top 0.5: C3.1 27.6,2.6 27.5,2.5 C2.1 28.3,2.7 v29,2 29.05,2.05 VREG1.5
  other vias: 20,13.3
  pour Route2 (isolate 0.35): 0,36 101,36 101,0 0,0
VCCA
  Top 0.25: U1.P9 20.75,19.25 22.35,19.25 C23.1 C4.1 L1.2
VCCM  (via drill 0.35, 0.5)  (9 unrouted)
  Top 0.25: D5.C 36.4,27 CN3.P$1
  Top 0.3: R17.2 30,11.2 30,7.5 30.5,7 32,7 v32.4,6.6 | CONN1.12 21.26,0.9 22.7,0.9 39.3,0.9 40.8,0.9 41.3,1.4 41.3,4.8 41.4,4.9 | v36,6.2 38.6,6.2 39.9,4.9 40.4,4.9
  Top 0.35: v55,30 59.6,30 L3.P$2
  Top 0.5: L2.P$2 49.45,2.25 46.8,4.9 42.4,4.9 41.4,4.9 40.4,4.9 39.9,4.9 D6.A
  Top 0.7: C26.1 95.5,9.5 | C27.1 95.6,8 95.5,7.9
  Top 0.75: 64,32.9 63.9,33 | 64,2.2 64.2,2 | C28.1 69.2,33 | C29.1 72.8,2
  Top 1.5: 58.55,4 L2.P$2 | 95.5,2.25 95.25,2
  Top 2: 58.6,2 64.2,2 72.8,2 CN2.1 95.25,2 | 58.6,2 58.55,4 | L3.P$2 61.8,33 | 61.8,33 63.9,33 69.2,33 91.5,33 95.5,29 95.5,9.5 95.5,7.9 95.5,2.25 | L4.P$2 L2.P$2 58.5,2.1 58.6,2 | L5.P$2 58.5,31.5 60,33 61.8,33
  Route2 2: 59,2.9 59.9,2 CN2.1 95.3,2 95.5,2.2 95.5,29 91.5,33 58,33 57.1,32.1
  Route15 0.3: v32.4,6.6 33.5,7.7 35.3,7.7 36,7 v36,6.2
  Route15 0.35: CN3.P$1 38.27,30 v55,30
  Route15 2: 58.9,2.9 59.8,2 CN2.1 95.3,2 95.5,2.2 95.5,29 91.5,33 58.1,33 57.1,32
  other vias: 62,2.5 65.5,1.4 80,2.5 95.4,1.5 96.1,11.1 96.1,13.8 95.5,27.4 92.6,31.1 77.4,33.6 61.5,32.4
VIN  (via drill 0.35)
  Top 0.3: R11.2 32.75,8.2 Q2.2 32.9,7.5 v33.8,6.6 | v37.3,1.7 37.3,2.5 37.4,2.7
  Top 0.5: D6.C 38.9,2.4 38.6,2.7 C1.1 37.4,2.7 C25.1 35.85,2.05 VREG1.1
  Route15 0.3: v33.8,6.6 33.8,5.2 v37.3,1.7

### Text on the board
Bottom: JAW 2015-07
tPlace: LEDCTL Rev. 1 | JAW 2015-07 | Pb | www.A791RL.com | PROG | Gnd | Vcc | Rx | Tx | nRST | BT0 | RST | BT0 | FAN + | - | 3V3 | L1 | HIGH VOLTAGE | DO NOT / TOUCH | SCL | + | SDA | + | L0 | GND | - | INPUT: 12V MAX | USERINT
tValues: L
bStop: JAW 2015-07